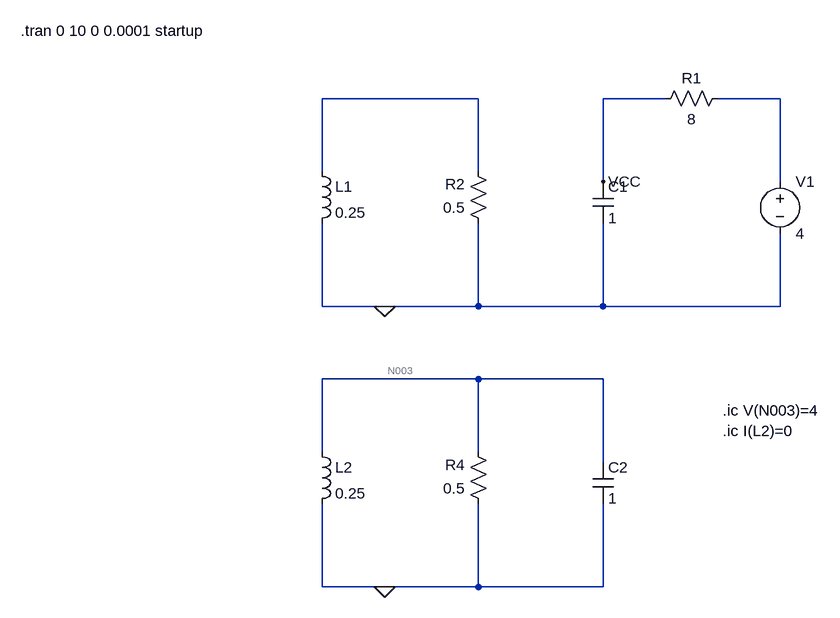
[diagram p0: schematic Q8_58.asc]
Q8_58.asc, the LTspice schematic file:
Version 4
SHEET 1 880 756
WIRE -128 -16 -368 -16
WIRE 160 -16 64 -16
WIRE 336 -16 240 -16
WIRE -368 96 -368 -16
WIRE -128 96 -128 -16
WIRE 64 112 64 -16
WIRE 336 112 336 -16
WIRE -368 304 -368 176
WIRE -272 304 -368 304
WIRE -128 304 -128 176
WIRE -128 304 -272 304
WIRE 64 304 64 176
WIRE 64 304 -128 304
WIRE 336 304 336 192
WIRE 336 304 64 304
WIRE -128 416 -368 416
WIRE 64 416 -128 416
WIRE -368 528 -368 416
WIRE -128 528 -128 416
WIRE 64 544 64 416
WIRE -368 736 -368 608
WIRE -272 736 -368 736
WIRE -128 736 -128 608
WIRE -128 736 -272 736
WIRE 64 736 64 608
WIRE 64 736 -128 736
FLAG -272 304 0
FLAG 64 112 VCC
FLAG -272 736 0
SYMBOL voltage 336 96 R0
WINDOW 123 0 0 Left 0
WINDOW 39 0 0 Left 0
SYMATTR InstName V1
SYMATTR Value 4
SYMBOL cap 48 112 R0
SYMATTR InstName C1
SYMATTR Value 1
SYMBOL res 256 -32 R90
WINDOW 0 0 56 VBottom 2
WINDOW 3 32 56 VTop 2
SYMATTR InstName R1
SYMATTR Value 8
SYMBOL res -112 192 R180
WINDOW 0 36 76 Left 2
WINDOW 3 36 40 Left 2
SYMATTR InstName R2
SYMATTR Value 0.5
SYMBOL ind -384 80 R0
SYMATTR InstName L1
SYMATTR Value 0.25
SYMBOL cap 48 544 R0
SYMATTR InstName C2
SYMATTR Value 1
SYMBOL res -112 624 R180
WINDOW 0 36 76 Left 2
WINDOW 3 36 40 Left 2
SYMATTR InstName R4
SYMATTR Value 0.5
SYMBOL ind -384 512 R0
SYMATTR InstName L2
SYMATTR Value 0.25
TEXT -832 -120 Left 2 !.tran 0 10 0 0.0001 startup
TEXT 248 464 Left 2 !.ic V(N003)=4
TEXT 248 496 Left 2 !.ic I(L2)=0

The netlist it stands for:
* Q8_58.asc
V1 N002 0 4
C1 VCC 0 1
R1 N002 VCC 8
R2 0 N001 0.5
L1 N001 0 0.25
C2 N003 0 1
R4 0 N003 0.5
L2 N003 0 0.25
.tran 0 10 0 0.0001 startup
.ic V(N003)=4
.ic I(L2)=0
.backanno
.end